# Altium schematic sheet Balanced Line Receiver.SchDoc
size Letter; SheetNumber: 2; SheetTotal: 14
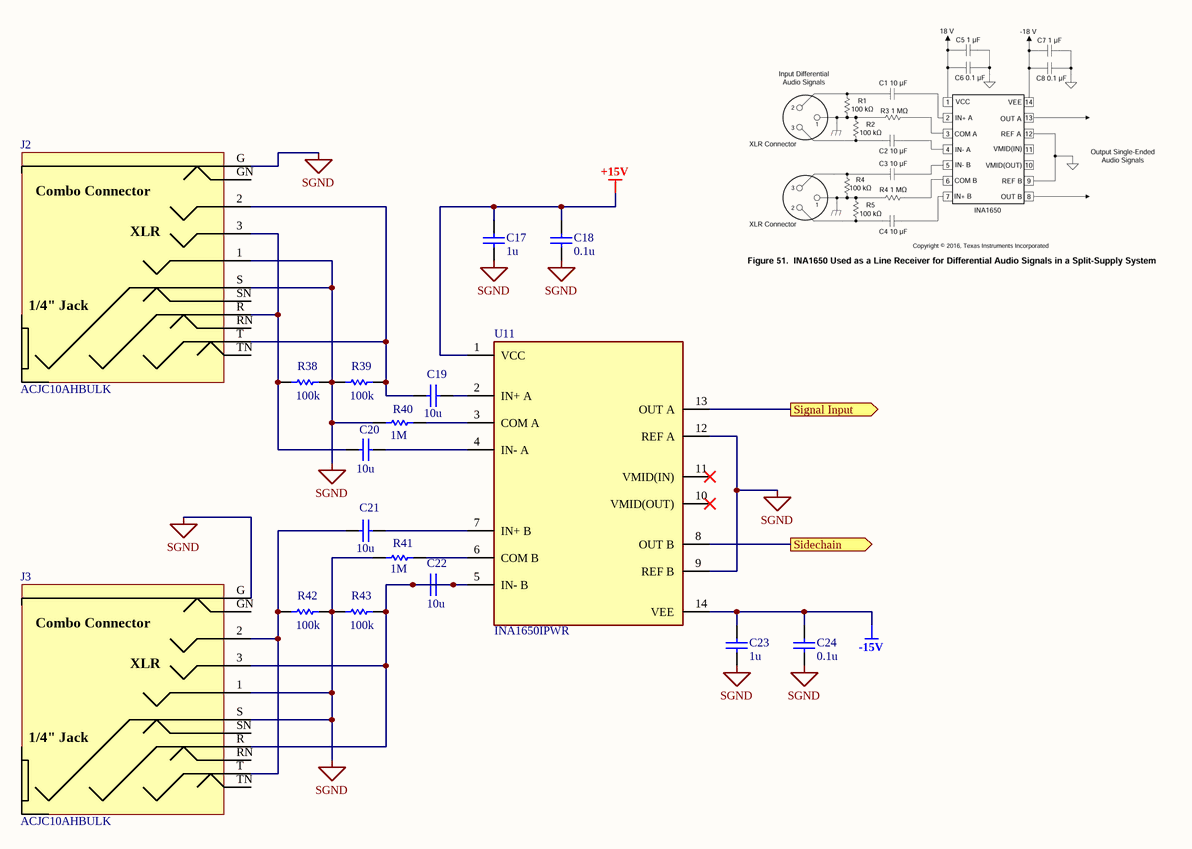
[diagram p0: Balanced Line Receiver.SchDoc]

## Parts
C17  value 1u  (hidden comment: Capacitor)
C18  value 0.1u  (hidden comment: Capacitor)
C19  value 10u  (hidden comment: Capacitor)
C20  value 10u  (hidden comment: Capacitor)
C21  value 10u  (hidden comment: Capacitor)
C22  value 10u  (hidden comment: Capacitor)
C23  value 1u  (hidden comment: Capacitor)
C24  value 0.1u  (hidden comment: Capacitor)
J2  ACJC10AHBULK  [ACJC10AH]
J3  ACJC10AHBULK  [ACJC10AH]
R38  value 100k  (hidden comment: Resistor)
R39  value 100k  (hidden comment: Resistor)
R40  value 1M  (hidden comment: Resistor)
R41  value 1M  (hidden comment: Resistor)
R42  value 100k  (hidden comment: Resistor)
R43  value 100k  (hidden comment: Resistor)
U11  INA1650IPWR  [FP-PW0014A-IPC_C]

## Ports
Sidechain (out), Signal Input (out)

## Nets
+15V: C17.2 C18.2 U11.1(VCC)
-15V: C23.2 C24.2 U11.14(VEE)
SGND: C17.1 C18.1 C23.1 C24.1 J2.1 J2.G J2.S J3.1 J3.G J3.S R38.1 R39.2 R40.2 R41.2 R42.1 R43.2 U11.9(REF_B) U11.12(REF_A)
Sidechain: U11.8(OUT_B) ; port Sidechain
Signal Input: U11.13(OUT_A) ; port Signal Input
NetC19_1: C19.1 U11.2(IN+_A)
NetC19_2: C19.2 J2.2 J2.T R39.1
NetC20_1: C20.1 U11.4(IN-_A)
NetC20_2: C20.2 J2.3 J2.R R38.2
NetC21_1: C21.1 U11.7(IN+_B)
NetC21_2: C21.2 J3.2 J3.T R42.2
NetC22_1: C22.1 C22.2 J3.3 J3.R R43.1 U11.5(IN-_B)
NetR40_1: R40.1 U11.3(COM_A)
NetR41_1: R41.1 U11.6(COM_B)

Not connected (* = marked no-connect by the designer): J2 GN RN SN TN; J3 GN RN SN TN; U11 10(VMID(OUT))* 11(VMID(IN))*

## Notes on the sheet
- (in symbol ACJC10AHBULK) Combo Connector; XLR; 1/4" Jack

## Library data of the parts
C17-C24 = Capacitor: SimulationGenericComponent: True
J2 J3 = ACJC10AHBULK: Audio/RCA Connector, 10 Pole(s), Female, Solder Terminal, Latch, Receptacle; Manufacturer: Amphenol; Supplier: Digikey; Supplier Part Number: 889-ACJC10AHBULK-ND; Manufacturer Part Number: ACJC10AHBULK; RoHS: Yes; Stock: 1003; Pricing: 1=3.96, 10=3.6, 25=3.4092, 50=3.33, 100=3.1714, 250=2.77496, 500=2.69568, 1000=2.29926, 2500=2.1407 (USD); Contact Finish - Mating: NOT SPECIFIED; Connector Type: AUDIO/RCA CONNECTOR; RoHS Compliant: Yes; ComponentLink1URL: https://datasheet.ciiva.com:443/pdfs/VipMasterIC/IC/AMPH/AMPHS14349/AMPHS14349-1.pdf?src-supplier=IHS+Markit; ComponentLink1Description: https://datasheet.ciiva.com:443/pdfs/VipMasterIC/IC/AMPH/AMPHS14349/AMPHS14349-1.pdf?src-supplier=IHS+Markit; ComponentLink2URL: https://datasheet.ciiva.com/15309/88010807000-acjc10ah-241575-15309467.pdf?src-supplier=Mouser; ComponentLink2Description: https://datasheet.ciiva.com/15309/88010807000-acjc10ah-241575-15309467.pdf?src-supplier=Mouser
R38-R43 = Resistor: TC1: 0; SimulationGenericComponent: True; TC2: 0
U11 = INA1650IPWR: IC AUDIO RECEIVER 14TSSOP; Number of Channels: 2; RoHS Compliant: Yes; Packaging: Tape and Reel; Number of Pins: 14; Min Operating Temperature: -40°C; Case/Package: TSSOP; Logic Function: Receiver; Max Operating Temperature: 125°C